# EAGLE design siguelineas (EAGLE 7.4.0)
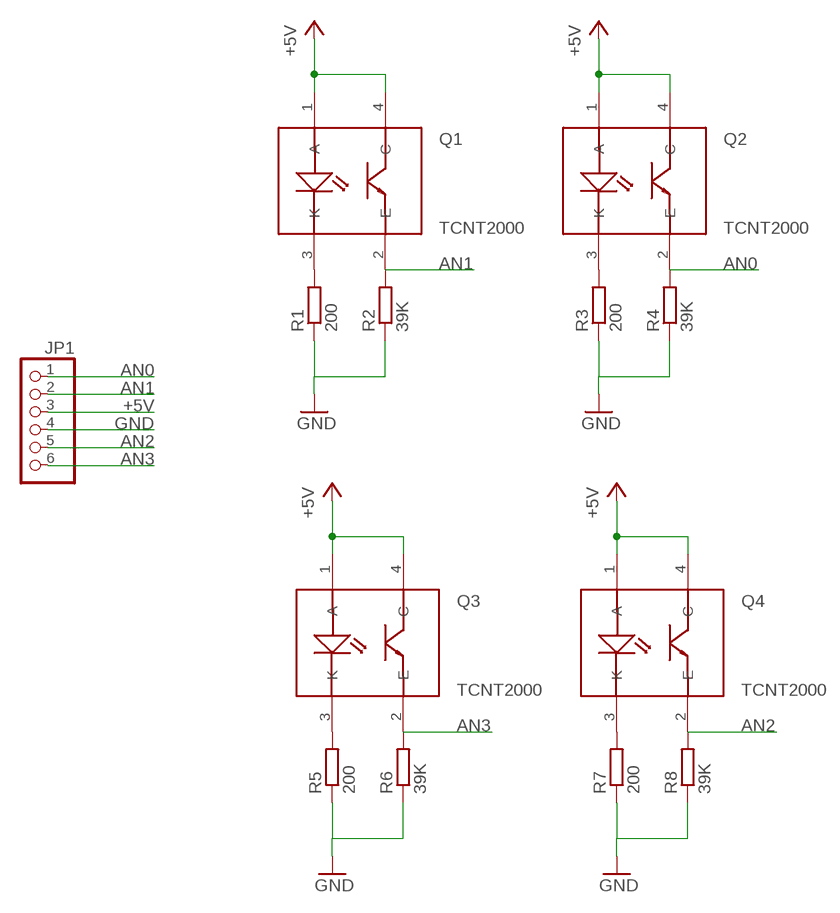
[diagram p0: schematic, sheet 1]

## Parts
JP1  PINHD-1X6  [1X06]
Q1  TCNT2000  [SMD]
Q2  TCNT2000  [SMD]
Q3  TCNT2000  [SMD]
Q4  TCNT2000  [SMD]
R1  200  R-EU_R0805  [R0805]
R2  39K  R-EU_R0805  [R0805]
R3  200  R-EU_R0805  [R0805]
R4  39K  R-EU_R0805  [R0805]
R5  200  R-EU_R0805  [R0805]
R6  39K  R-EU_R0805  [R0805]
R7  200  R-EU_R0805  [R0805]
R8  39K  R-EU_R0805  [R0805]

## Nets
+5V: JP1.3 Q1.1(A) Q1.4(C) Q2.1(A) Q2.4(C) Q3.1(A) Q3.4(C) Q4.1(A) Q4.4(C)
AN0: JP1.1 Q2.2(E) R4.2
AN1: JP1.2 Q1.2(E) R2.2
AN2: JP1.5 Q4.2(E) R8.2
AN3: JP1.6 Q3.2(E) R6.2
GND: JP1.4 R1.1 R2.1 R3.1 R4.1 R5.1 R6.1 R7.1 R8.1
N$1: Q1.3(K) R1.2
N$2: Q2.3(K) R3.2
N$3: Q3.3(K) R5.2
N$4: Q4.3(K) R7.2

## Library data of the parts
JP1 = pinhead:PINHD-1X6: PIN HEADER
Q1-Q4 = Siguelineas:TCNT2000
R1-R8 = rcl:R-EU_: RESISTOR, European symbol

## Board
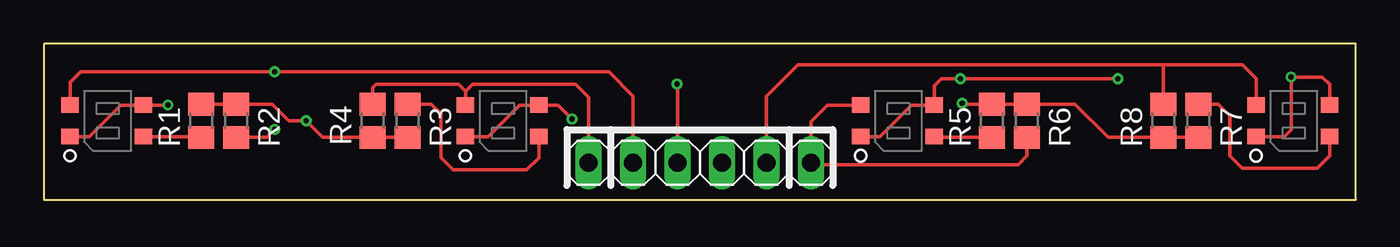
[diagram p1: board, top side]
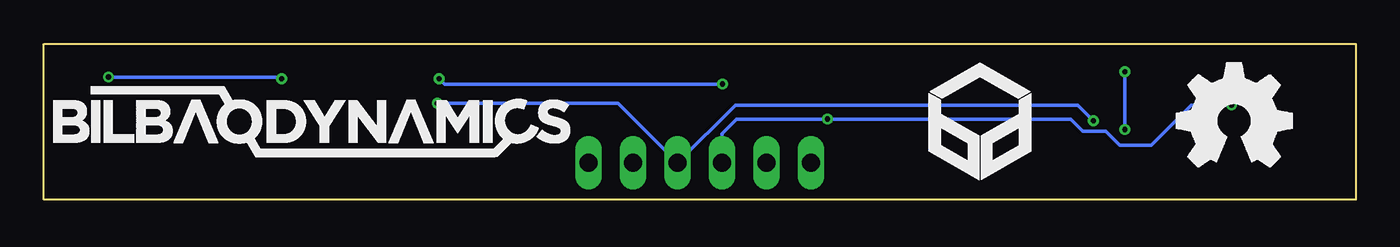
[diagram p2: board, bottom side, seen from below]

Size 75 x 8.9 mm. Coordinates in mm from the lower left corner, seen from the top.
Outline: 0,0 75,0 75,8.9 0,8.9 0,0
Copper layers (1*16): Top 0.035mm / dielectric 1.5mm / Bottom 0.035mm
Design rules "EagleRules": minimum track width 7mil, minimum drill 12mil, track to track 7mil, track to pad 7mil, pad to pad 7mil, via to via 7mil, smd to smd 0mil, copper to edge 20mil, drill to drill 10mil, minimum pad ring 10mil, minimum via ring 6mil, stop-mask expansion 2mil, vias tented up to drill 25mil, thermal gap 10mil

### Footprints (pad centres in the part's own frame; a part is rotated, then mirrored left to right if it is on the bottom)
1X06 = drill 1.016 long: 1 -6.35,0; 2 -3.81,0; 3 -1.27,0; 4 1.27,0; 5 3.81,0; 6 6.35,0
SMD = smd 0.9 x 1: 1 0,0; 2 1.8,0; 3 0,-4.2; 4 1.8,-4.2
R0805 = smd 1.3 x 1.5: 1 -0.95,0; 2 0.95,0

### Placement (x,y rotation side)
JP1  37.5,2.1 0 top
Q1  1.5,3.6 90 top
Q2  24.1,3.6 90 top
Q3  46.7,3.6 90 top
Q4  69.3,3.6 90 top
R1  9,4.5 270 top
R2  11,4.5 270 top
R3  20.8,4.5 90 top
R4  18.8,4.5 90 top
R5  54.2,4.5 270 top
R6  56.2,4.5 270 top
R7  66,4.5 90 top
R8  64,4.5 90 top

### Tracks (layer width: path | path; a pad name or v marks a point on that pad's centre or on a via)
+5V  (via drill 0.3 pad 0.61)
  Top 0.203: Q2.1 25.4,3.6 27.2,5.4 Q2.4 29.4,5.4 v30.2,4.6 | v61.4,6.9 v52.4,6.9 51.3,6.9 50.9,6.5 Q3.4 49.6,5.4 47.8,3.6 Q3.1 | Q4.4 73.5,6.58 73.08,7 v71.3,7 71.3,4 70.9,3.6 Q4.1 | v7.1,5.4 Q1.4 4.4,5.4 2.6,3.6 Q1.1 | JP1.3 36.23,6.57 v36.2,6.6
  Bottom 0.203: v61.4,6.9 61.5,7 v71.3,7 | v36.2,6.6 52.1,6.6 v52.4,6.9 | v7.1,5.4 9.4,5.4 11.7,3.1 13.5,3.1 14.3,3.9 15.6,3.9 16.3,4.6 v30.2,4.6 35.4,4.6 36.23,3.77 JP1.3
AN0
  Top 0.203: 24.1,6.2 23.7,6.6 19,6.6 18.8,6.4 R4.2 | Q2.2 24.1,6.2 | 24.1,6.2 24.5,6.6 30.4,6.6 31.15,5.85 JP1.1
AN1  (via drill 0.3 pad 0.61)
  Top 0.203: Q1.2 1.5,6.7 2.1,7.3 v13.2,7.3 32.3,7.3 33.69,5.91 JP1.2 | R2.2 12.75,3.55 v13.2,4
  Bottom 0.203: v13.2,4 v13.2,7.3
AN2
  Top 0.203: 64.1,7.7 68.5,7.7 69.3,6.9 Q4.2 | 64.1,7.7 43.1,7.7 41.3,5.9 JP1.5 | R8.2 64,7.6 64.1,7.7
AN3
  Top 0.203: R6.2 56.2,2.5 55.7,2 43.95,2 JP1.6 43.85,4.45 44.8,5.4 Q3.2
GND  (via drill 0.3 pad 0.61)
  Top 0.203: R7.1 R8.1 60.85,3.55 58.95,5.45 R6.1 | R6.1 56.25,5.45 | 56.25,5.45 56.3,5.5 56.3,5.4 56.25,5.45 | R6.1 R5.1 52.55,5.45 v52.5,5.5 | R1.1 R2.1 13.05,5.45 14,4.5 v15,4.5 15.95,3.55 R4.1 R3.1
  Bottom 0.203: v52.5,5.5 42.17,5.5 JP1.4 35.47,5.4 15.9,5.4 v15,4.5
N$1
  Top 0.203: Q1.3 8.95,3.6 R1.2
N$2
  Top 0.203: R3.2 22.15,5.45 22.7,4.9 22.7,2.4 23.4,1.7 27.6,1.7 28.3,2.4 Q2.3
N$3
  Top 0.203: Q3.3 50.95,3.55 R5.2
N$4
  Top 0.203: R7.2 67.15,5.45 67.8,4.8 67.8,2.5 68.5,1.8 72.8,1.8 73.5,2.5 Q4.3